# Altium schematic sheet PowerSupplies.SchDoc: Power Supplies
size A; DocumentNumber: 2; SheetNumber: 2; SheetTotal: 9
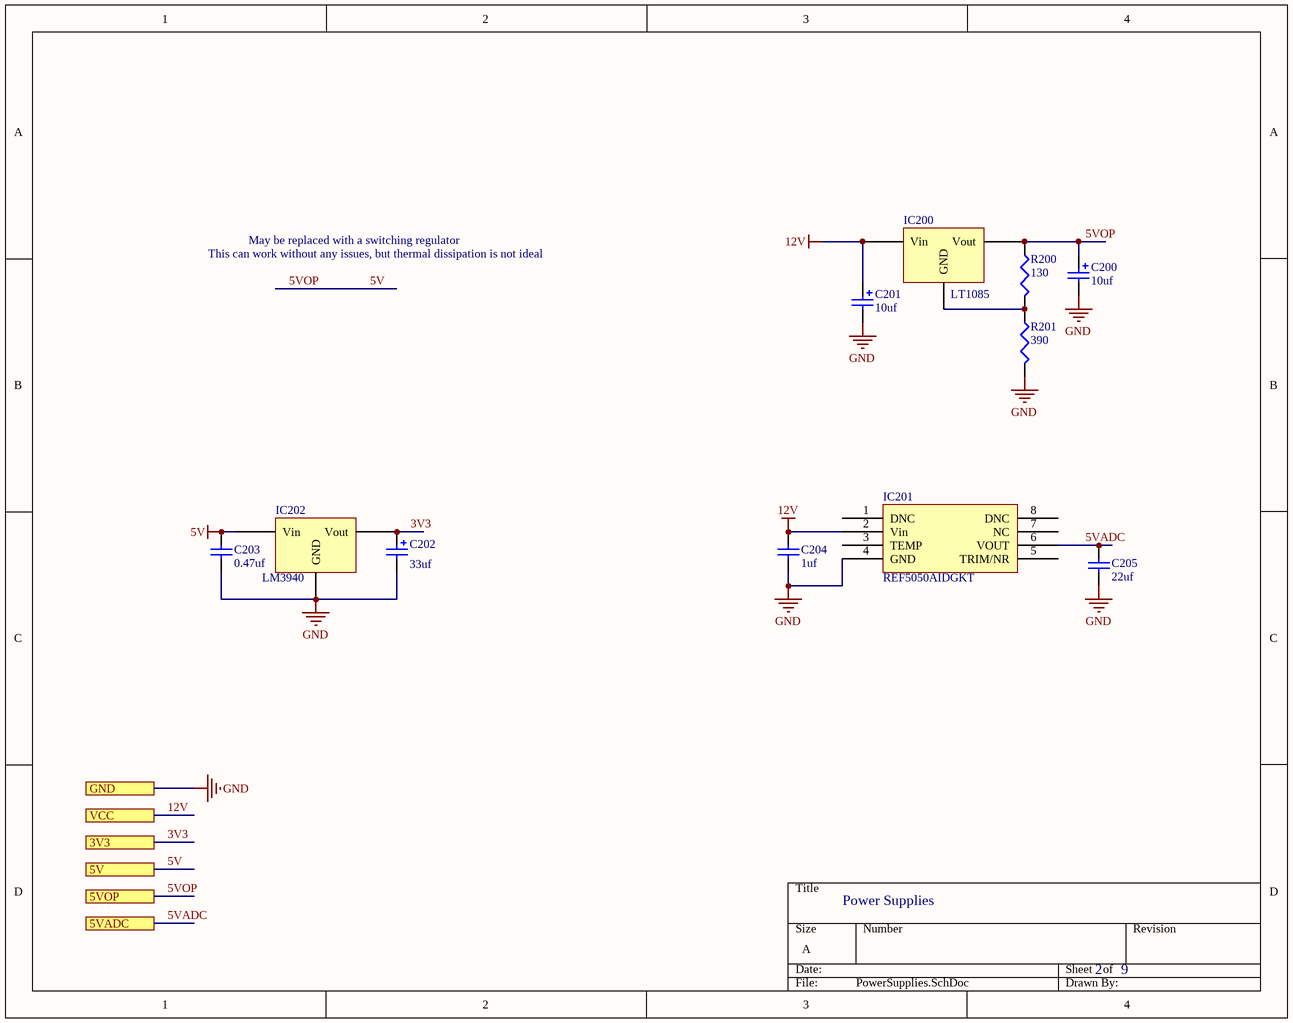
[diagram p0: PowerSupplies.SchDoc]

## Parts
C200  value 10uf  [SMD1206 Polarized]  (hidden comment: Cap)
C201  value 10uf  [SMD1206 Polarized]  (hidden comment: Cap)
C202  value 33uf  [SMD1206 Polarized]  (hidden comment: Cap)
C203  value 0.47uf  [SMD0603]  (hidden comment: Cap)
C204  value 1uf  [SMD0603]  (hidden comment: Capacitor Ceramic)
C205  value 22uf  [SMD1206]  (hidden comment: Capacitor Ceramic)
IC200  LT1085  [DPAK - 3pin]
IC201  REF5050AIDGKT  [VSSOP-8 (DGK)]
IC202  LM3940  [SOT-223]
R200  value 130  [SMD0603]  (hidden comment: Res)
R201  value 390  [SMD0603]  (hidden comment: Res)

## Ports
3V3, 5V, 5VADC, 5VOP, GND, VCC

## Nets
5V: C200.1 C203.2 IC200.Vout IC202.Vin R200.1 ; port 5V, port 5VOP  [also labelled 5VOP]
12V: C201.1 C204.2 IC200.Vin IC201.2(Vin) ; port VCC
GND: C200.2 C201.2 C202.2 C203.1 C204.1 C205.1 IC201.4(GND) IC202.GND R201.2 ; port GND
3V3: C202.1 IC202.Vout ; port 3V3
5VADC: C205.2 IC201.6(VOUT) ; port 5VADC
NetIC200_GND: IC200.GND R200.2 R201.1

Not connected (* = marked no-connect by the designer): IC201 1(DNC) 3(TEMP) 5(TRIM/NR) 7(NC) 8(DNC)

## Notes on the sheet
- This can work without any issues, but thermal dissipation is not ideal
- May be replaced with a switching regulator

## Library data of the parts
C200-C202 = Capacitor Polarized: Polarized Capacitor (Surface Mount)
C203-C205 = Capacitor Ceramic: Ceramic Chip Capacitor
IC200 = LT1085: 3A DC/DC Converter (SM); pin to pad: GND>1 Vin>3 Vout>2
IC201 = REF5050AIDGKT: 5V Precision Reference Voltage
IC202 = LM3940: 3.3V 1A LDO; pin to pad: GND>2 Vin>1 Vout>3
R200 R201 = Resistor